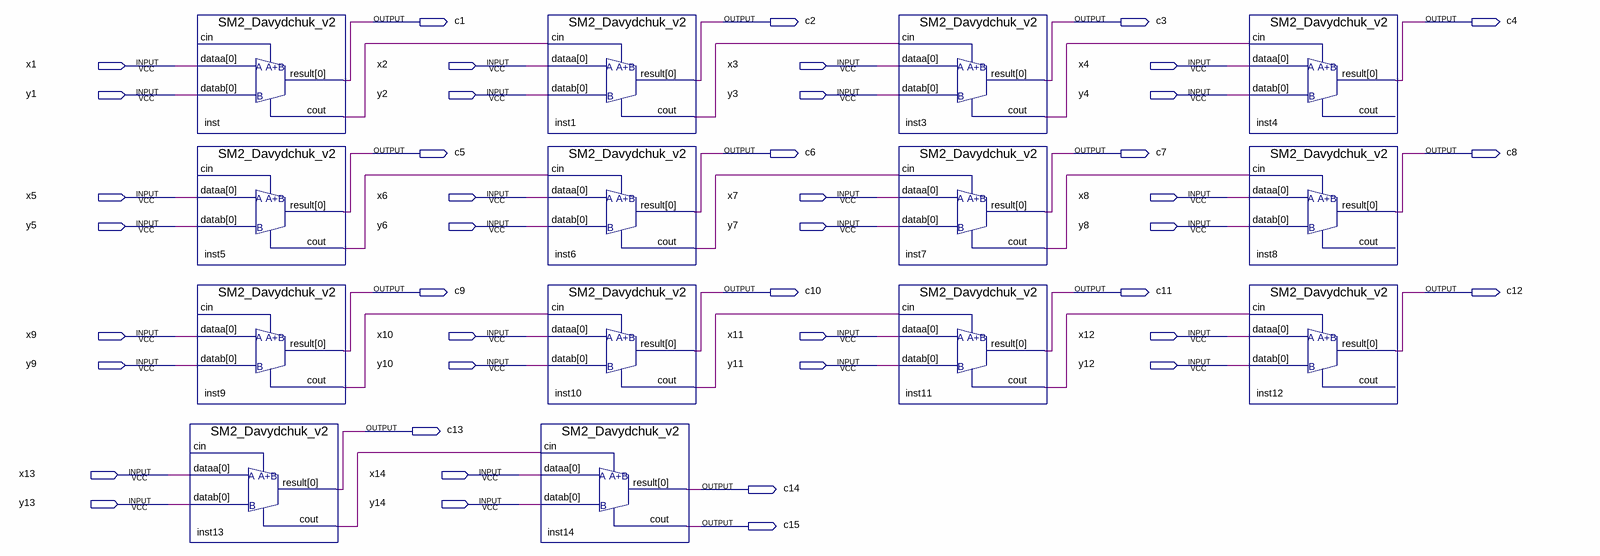
[diagram p0: schematic sheet]
// Quartus schematic SUM14bits_ArtemDavydchuk.bdf as structural Verilog: 14 symbols, 43 pins
module SUM14bits_ArtemDavydchuk (
  input  x1,
  input  x2,
  input  x3,
  input  x4,
  input  y1,
  input  y2,
  input  y3,
  input  y4,
  input  x5,
  input  x6,
  input  x7,
  input  x8,
  input  y5,
  input  y6,
  input  y7,
  input  y8,
  input  x9,
  input  x10,
  input  x11,
  input  x12,
  input  y9,
  input  y10,
  input  y11,
  input  y12,
  input  x13,
  input  x14,
  input  y13,
  input  y14,
  output c1,
  output c2,
  output c3,
  output c4,
  output c5,
  output c6,
  output c7,
  output c8,
  output c9,
  output c10,
  output c11,
  output c12,
  output c13,
  output c14,
  output c15
);

  wire inst1_cout, inst3_cout, inst5_cout, inst6_cout, inst7_cout, inst9_cout, inst10_cout, inst11_cout,
       inst13_cout, inst_cout;

  SM2_Davydchuk_v2 inst (.dataa(x1), .datab(y1), .result(c1), .cout(inst_cout));  // open: cin
  SM2_Davydchuk_v2 inst5 (.dataa(x5), .datab(y5), .result(c5), .cout(inst5_cout));  // open: cin
  SM2_Davydchuk_v2 inst9 (.dataa(x9), .datab(y9), .result(c9), .cout(inst9_cout));  // open: cin
  SM2_Davydchuk_v2 inst13 (.dataa(x13), .datab(y13), .result(c13), .cout(inst13_cout));  // open: cin
  SM2_Davydchuk_v2 inst1 (.cin(inst_cout), .dataa(x2), .datab(y2), .result(c2), .cout(inst1_cout));
  SM2_Davydchuk_v2 inst6 (.cin(inst5_cout), .dataa(x6), .datab(y6), .result(c6), .cout(inst6_cout));
  SM2_Davydchuk_v2 inst10 (.cin(inst9_cout), .dataa(x10), .datab(y10), .result(c10), .cout(inst10_cout));
  SM2_Davydchuk_v2 inst14 (.cin(inst13_cout), .dataa(x14), .datab(y14), .result(c14), .cout(c15));
  SM2_Davydchuk_v2 inst3 (.cin(inst1_cout), .dataa(x3), .datab(y3), .result(c3), .cout(inst3_cout));
  SM2_Davydchuk_v2 inst7 (.cin(inst6_cout), .dataa(x7), .datab(y7), .result(c7), .cout(inst7_cout));
  SM2_Davydchuk_v2 inst11 (.cin(inst10_cout), .dataa(x11), .datab(y11), .result(c11), .cout(inst11_cout));
  SM2_Davydchuk_v2 inst4 (.cin(inst3_cout), .dataa(x4), .datab(y4), .result(c4));  // open: cout
  SM2_Davydchuk_v2 inst8 (.cin(inst7_cout), .dataa(x8), .datab(y8), .result(c8));  // open: cout
  SM2_Davydchuk_v2 inst12 (.cin(inst11_cout), .dataa(x12), .datab(y12), .result(c12));  // open: cout
endmodule
